# Altium schematic sheet project_pankov_2_mcu.SchDoc: =title_line_1 + title_line_2
size 891 x 420 mm; SheetNumber: 2
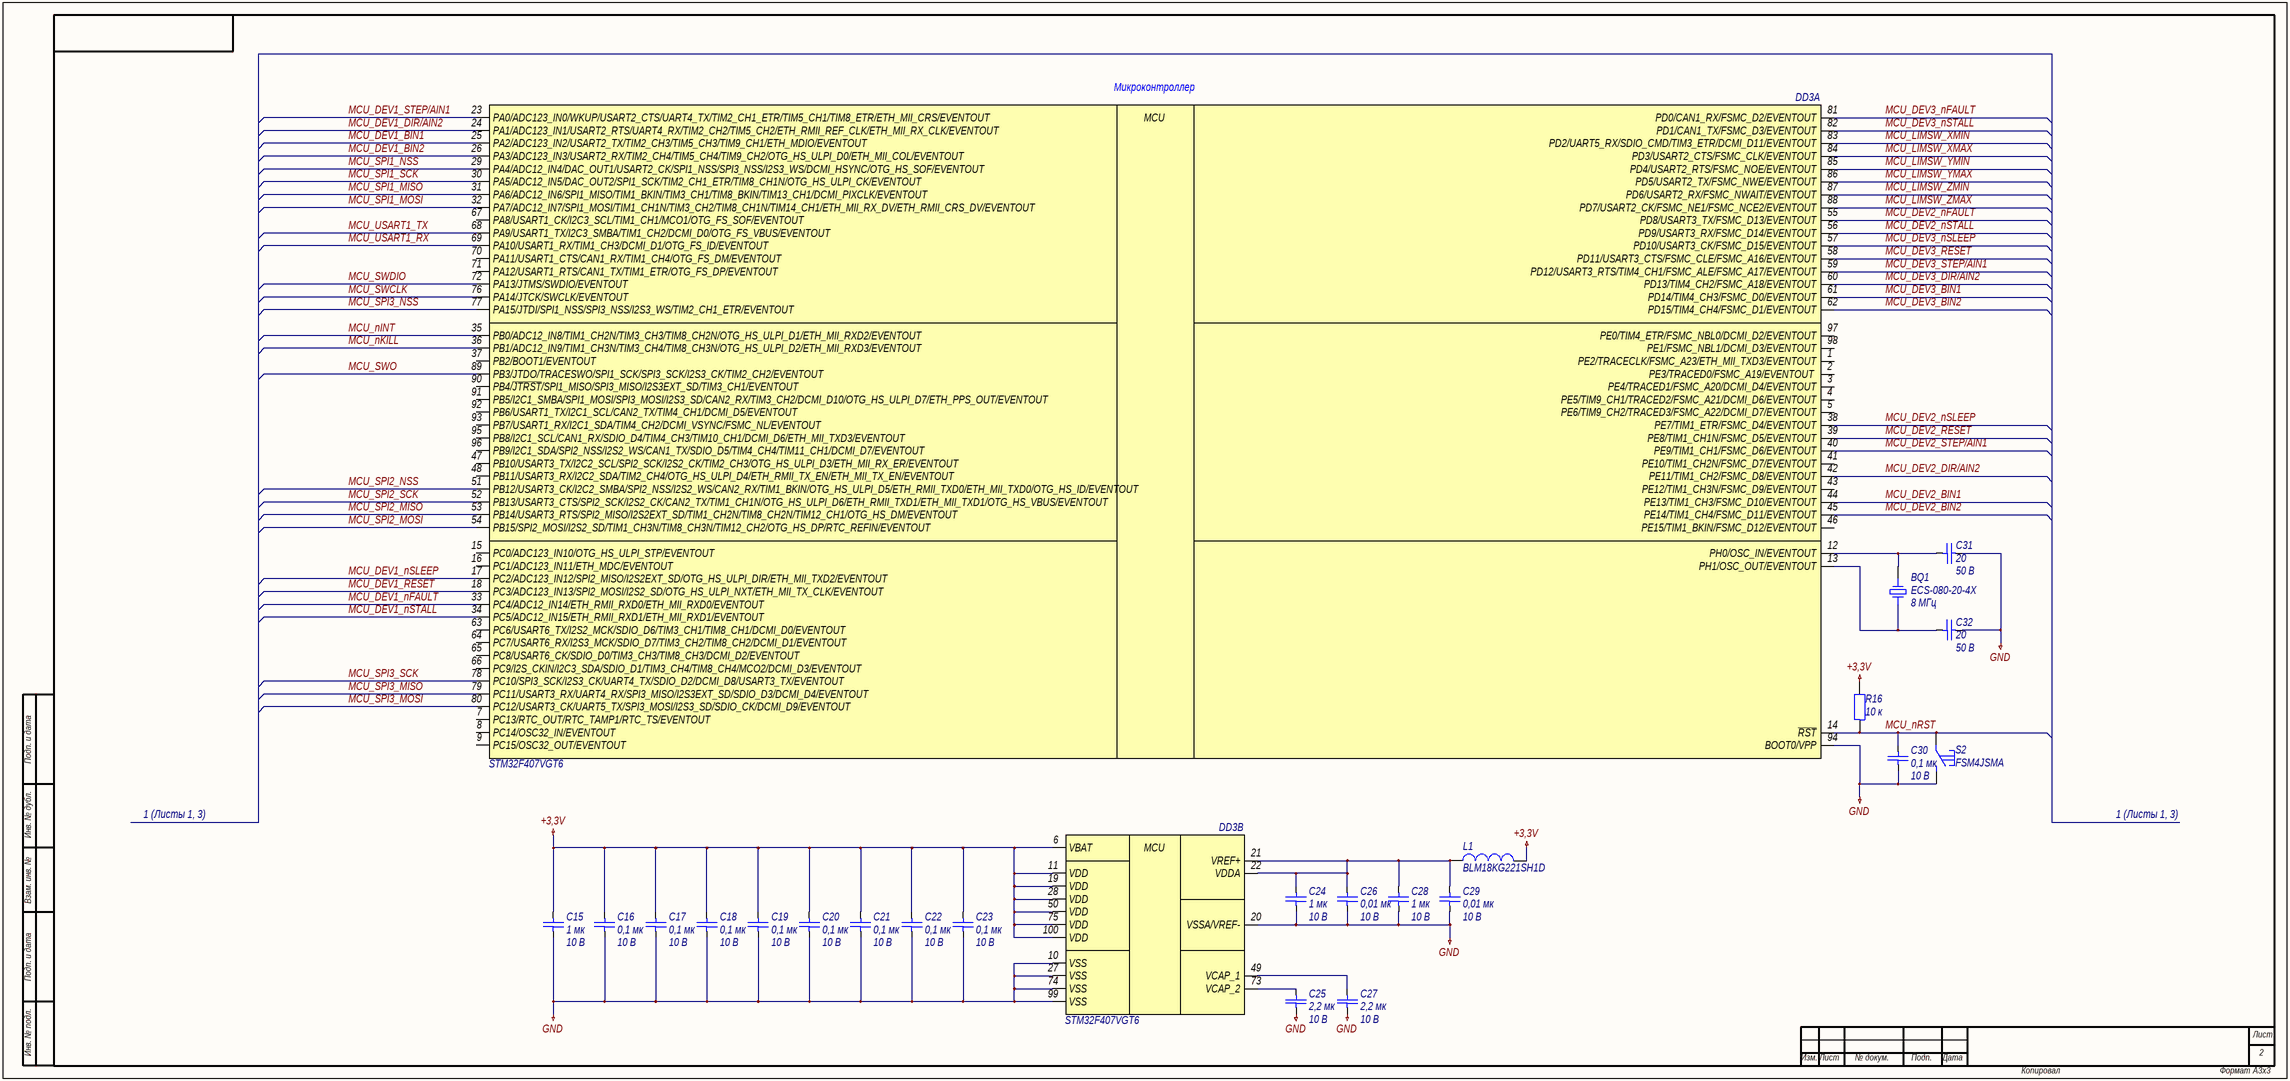
[diagram p0: project_pankov_2_mcu.SchDoc]

## Parts
BQ1  ECS-080-20-4X  Частотa: 8 МГц  [HC-49/US]
C15  1 мк  Напряжение: 10 В  [C0603]
C16  0,1 мк  Напряжение: 10 В  [C0603]
C17  0,1 мк  Напряжение: 10 В  [C0603]
C18  0,1 мк  Напряжение: 10 В  [C0603]
C19  0,1 мк  Напряжение: 10 В  [C0603]
C20  0,1 мк  Напряжение: 10 В  [C0603]
C21  0,1 мк  Напряжение: 10 В  [C0603]
C22  0,1 мк  Напряжение: 10 В  [C0603]
C23  0,1 мк  Напряжение: 10 В  [C0603]
C24  1 мк  Напряжение: 10 В  [C0603]
C25  2,2 мк  Напряжение: 10 В  [C0603]
C26  0,01 мк  Напряжение: 10 В  [C0603]
C27  2,2 мк  Напряжение: 10 В  [C0603]
C28  1 мк  Напряжение: 10 В  [C0603]
C29  0,01 мк  Напряжение: 10 В  [C0603]
C30  0,1 мк  Напряжение: 10 В  [C0603]
C31  20  Напряжение: 50 В  [C0603]
C32  20  Напряжение: 50 В  [C0603]
DD3  STM32F407VGT6  [LQFP-100-P50-1400X1400X160-L60X22]  (parts A,B of 2)
L1  BLM18KG221SH1D  [BLM-2-0603]
R16  10 к  [R0603]
S2  FSM4JSMA  [FSM4JSMA]

## Nets
+3,3V: C15.1 C16.1 C17.1 C18.1 C19.1 C20.1 C21.1 C22.1 C23.1 DD3.6(VBAT) DD3.11(VDD) DD3.19(VDD) DD3.28(VDD) DD3.50(VDD) DD3.75(VDD) DD3.100(VDD) L1.2 R16.2
GND: C15.2 C16.2 C17.2 C18.2 C19.2 C20.2 C21.2 C22.2 C23.2 C24.2 C25.2 C26.2 C27.2 C28.2 C29.2 C30.2 C31.1 C32.1 DD3.10(VSS) DD3.20(VSSA/VREF-) DD3.27(VSS) DD3.74(VSS) DD3.94(BOOT0/VPP) DD3.99(VSS) S2.2
MCU_DEV1_BIN1: DD3.25(PA2/ADC123_IN2/USART2_TX/TIM2_CH3/TIM5_CH3/TIM9_CH1/ETH_MDIO/EVENTOUT)
MCU_DEV1_BIN2: DD3.26(PA3/ADC123_IN3/USART2_RX/TIM2_CH4/TIM5_CH4/TIM9_CH2/OTG_HS_ULPI_D0/ETH_MII_COL/EVENTOUT)
MCU_DEV1_DIR/AIN2: DD3.24(PA1/ADC123_IN1/USART2_RTS/UART4_RX/TIM2_CH2/TIM5_CH2/ETH_RMII_REF_CLK/ETH_MII_RX_CLK/EVENTOUT)
MCU_DEV1_nFAULT: DD3.33(PC4/ADC12_IN14/ETH_RMII_RXD0/ETH_MII_RXD0/EVENTOUT)
MCU_DEV1_nSLEEP: DD3.17(PC2/ADC123_IN12/SPI2_MISO/I2S2EXT_SD/OTG_HS_ULPI_DIR/ETH_MII_TXD2/EVENTOUT)
MCU_DEV1_nSTALL: DD3.34(PC5/ADC12_IN15/ETH_RMII_RXD1/ETH_MII_RXD1/EVENTOUT)
MCU_DEV1_RESET: DD3.18(PC3/ADC123_IN13/SPI2_MOSI/I2S2_SD/OTG_HS_ULPI_NXT/ETH_MII_TX_CLK/EVENTOUT)
MCU_DEV1_STEP/AIN1: DD3.23(PA0/ADC123_IN0/WKUP/USART2_CTS/UART4_TX/TIM2_CH1_ETR/TIM5_CH1/TIM8_ETR/ETH_MII_CRS/EVENTOUT)
MCU_DEV2_BIN1: DD3.44(PE13/TIM1_CH3/FSMC_D10/EVENTOUT)
MCU_DEV2_BIN2: DD3.45(PE14/TIM1_CH4/FSMC_D11/EVENTOUT)
MCU_DEV2_DIR/AIN2: DD3.42(PE11/TIM1_CH2/FSMC_D8/EVENTOUT)
MCU_DEV2_nFAULT: DD3.55(PD8/USART3_TX/FSMC_D13/EVENTOUT)
MCU_DEV2_nSLEEP: DD3.38(PE7/TIM1_ETR/FSMC_D4/EVENTOUT)
MCU_DEV2_nSTALL: DD3.56(PD9/USART3_RX/FSMC_D14/EVENTOUT)
MCU_DEV2_RESET: DD3.39(PE8/TIM1_CH1N/FSMC_D5/EVENTOUT)
MCU_DEV2_STEP/AIN1: DD3.40(PE9/TIM1_CH1/FSMC_D6/EVENTOUT)
MCU_DEV3_BIN1: DD3.61(PD14/TIM4_CH3/FSMC_D0/EVENTOUT)
MCU_DEV3_BIN2: DD3.62(PD15/TIM4_CH4/FSMC_D1/EVENTOUT)
MCU_DEV3_DIR/AIN2: DD3.60(PD13/TIM4_CH2/FSMC_A18/EVENTOUT)
MCU_DEV3_nFAULT: DD3.81(PD0/CAN1_RX/FSMC_D2/EVENTOUT)
MCU_DEV3_nSLEEP: DD3.57(PD10/USART3_CK/FSMC_D15/EVENTOUT)
MCU_DEV3_nSTALL: DD3.82(PD1/CAN1_TX/FSMC_D3/EVENTOUT)
MCU_DEV3_RESET: DD3.58(PD11/USART3_CTS/FSMC_CLE/FSMC_A16/EVENTOUT)
MCU_DEV3_STEP/AIN1: DD3.59(PD12/USART3_RTS/TIM4_CH1/FSMC_ALE/FSMC_A17/EVENTOUT)
MCU_LIMSW_XMAX: DD3.84(PD3/USART2_CTS/FSMC_CLK/EVENTOUT)
MCU_LIMSW_XMIN: DD3.83(PD2/UART5_RX/SDIO_CMD/TIM3_ETR/DCMI_D11/EVENTOUT)
MCU_LIMSW_YMAX: DD3.86(PD5/USART2_TX/FSMC_NWE/EVENTOUT)
MCU_LIMSW_YMIN: DD3.85(PD4/USART2_RTS/FSMC_NOE/EVENTOUT)
MCU_LIMSW_ZMAX: DD3.88(PD7/USART2_CK/FSMC_NE1/FSMC_NCE2/EVENTOUT)
MCU_LIMSW_ZMIN: DD3.87(PD6/USART2_RX/FSMC_NWAIT/EVENTOUT)
MCU_nINT: DD3.35(PB0/ADC12_IN8/TIM1_CH2N/TIM3_CH3/TIM8_CH2N/OTG_HS_ULPI_D1/ETH_MII_RXD2/EVENTOUT)
MCU_nKILL: DD3.36(PB1/ADC12_IN9/TIM1_CH3N/TIM3_CH4/TIM8_CH3N/OTG_HS_ULPI_D2/ETH_MII_RXD3/EVENTOUT)
MCU_nRST: C30.1 DD3.14(~{RST}) R16.1 S2.1
MCU_SPI1_MISO: DD3.31(PA6/ADC12_IN6/SPI1_MISO/TIM1_BKIN/TIM3_CH1/TIM8_BKIN/TIM13_CH1/DCMI_PIXCLK/EVENTOUT)
MCU_SPI1_MOSI: DD3.32(PA7/ADC12_IN7/SPI1_MOSI/TIM1_CH1N/TIM3_CH2/TIM8_CH1N/TIM14_CH1/ETH_MII_RX_DV/ETH_RMII_CRS_DV/EVENTOUT)
MCU_SPI1_NSS: DD3.29(PA4/ADC12_IN4/DAC_OUT1/USART2_CK/SPI1_NSS/SPI3_NSS/I2S3_WS/DCMI_HSYNC/OTG_HS_SOF/EVENTOUT)
MCU_SPI1_SCK: DD3.30(PA5/ADC12_IN5/DAC_OUT2/SPI1_SCK/TIM2_CH1_ETR/TIM8_CH1N/OTG_HS_ULPI_CK/EVENTOUT)
MCU_SPI2_MISO: DD3.53(PB14/USART3_RTS/SPI2_MISO/I2S2EXT_SD/TIM1_CH2N/TIM8_CH2N/TIM12_CH1/OTG_HS_DM/EVENTOUT)
MCU_SPI2_MOSI: DD3.54(PB15/SPI2_MOSI/I2S2_SD/TIM1_CH3N/TIM8_CH3N/TIM12_CH2/OTG_HS_DP/RTC_REFIN/EVENTOUT)
MCU_SPI2_NSS: DD3.51(PB12/USART3_CK/I2C2_SMBA/SPI2_NSS/I2S2_WS/CAN2_RX/TIM1_BKIN/OTG_HS_ULPI_D5/ETH_RMII_TXD0/ETH_MII_TXD0/OTG_HS_ID/EVENTOUT)
MCU_SPI2_SCK: DD3.52(PB13/USART3_CTS/SPI2_SCK/I2S2_CK/CAN2_TX/TIM1_CH1N/OTG_HS_ULPI_D6/ETH_RMII_TXD1/ETH_MII_TXD1/OTG_HS_VBUS/EVENTOUT)
MCU_SPI3_MISO: DD3.79(PC11/USART3_RX/UART4_RX/SPI3_MISO/I2S3EXT_SD/SDIO_D3/DCMI_D4/EVENTOUT)
MCU_SPI3_MOSI: DD3.80(PC12/USART3_CK/UART5_TX/SPI3_MOSI/I2S3_SD/SDIO_CK/DCMI_D9/EVENTOUT)
MCU_SPI3_NSS: DD3.77(PA15/JTDI/SPI1_NSS/SPI3_NSS/I2S3_WS/TIM2_CH1_ETR/EVENTOUT)
MCU_SPI3_SCK: DD3.78(PC10/SPI3_SCK/I2S3_CK/UART4_TX/SDIO_D2/DCMI_D8/USART3_TX/EVENTOUT)
MCU_SWCLK: DD3.76(PA14/JTCK/SWCLK/EVENTOUT)
MCU_SWDIO: DD3.72(PA13/JTMS/SWDIO/EVENTOUT)
MCU_SWO: DD3.89(PB3/JTDO/TRACESWO/SPI1_SCK/SPI3_SCK/I2S3_CK/TIM2_CH2/EVENTOUT)
MCU_USART1_RX: DD3.69(PA10/USART1_RX/TIM1_CH3/DCMI_D1/OTG_FS_ID/EVENTOUT)
MCU_USART1_TX: DD3.68(PA9/USART1_TX/I2C3_SMBA/TIM1_CH2/DCMI_D0/OTG_FS_VBUS/EVENTOUT)
NetBQ1_1: BQ1.1 C32.2 DD3.13(PH1/OSC_OUT/EVENTOUT)
NetBQ1_2: BQ1.2 C31.2 DD3.12(PH0/OSC_IN/EVENTOUT)
NetC24_1: C24.1 C26.1 C28.1 C29.1 DD3.21(VREF+) DD3.22(VDDA) L1.1
NetC25_1: C25.1 DD3.73(VCAP_2)
NetC27_1: C27.1 DD3.49(VCAP_1)

Not connected (* = marked no-connect by the designer): DD3 1(PE2/TRACECLK/FSMC_A23/ETH_MII_TXD3/EVENTOUT) 2(PE3/TRACED0/FSMC_A19/EVENTOUT_) 3(PE4/TRACED1/FSMC_A20/DCMI_D4/EVENTOUT) 4(PE5/TIM9_CH1/TRACED2/FSMC_A21/DCMI_D6/EVENTOUT) 5(PE6/TIM9_CH2/TRACED3/FSMC_A22/DCMI_D7/EVENTOUT) 7(PC13/RTC_OUT/RTC_TAMP1/RTC_TS/EVENTOUT) 8(PC14/OSC32_IN/EVENTOUT) 9(PC15/OSC32_OUT/EVENTOUT) 15(PC0/ADC123_IN10/OTG_HS_ULPI_STP/EVENTOUT) 16(PC1/ADC123_IN11/ETH_MDC/EVENTOUT) 37(PB2/BOOT1/EVENTOUT) 41(PE10/TIM1_CH2N/FSMC_D7/EVENTOUT) 43(PE12/TIM1_CH3N/FSMC_D9/EVENTOUT) 46(PE15/TIM1_BKIN/FSMC_D12/EVENTOUT) 47(PB10/USART3_TX/I2C2_SCL/SPI2_SCK/I2S2_CK/TIM2_CH3/OTG_HS_ULPI_D3/ETH_MII_RX_ER/EVENTOUT) 48(PB11/USART3_RX/I2C2_SDA/TIM2_CH4/OTG_HS_ULPI_D4/ETH_RMII_TX_EN/ETH_MII_TX_EN/EVENTOUT) 63(PC6/USART6_TX/I2S2_MCK/SDIO_D6/TIM3_CH1/TIM8_CH1/DCMI_D0/EVENTOUT) 64(PC7/USART6_RX/I2S3_MCK/SDIO_D7/TIM3_CH2/TIM8_CH2/DCMI_D1/EVENTOUT) 65(PC8/USART6_CK/SDIO_D0/TIM3_CH3/TIM8_CH3/DCMI_D2/EVENTOUT) 66(PC9/I2S_CKIN/I2C3_SDA/SDIO_D1/TIM3_CH4/TIM8_CH4/MCO2/DCMI_D3/EVENTOUT) 67(PA8/USART1_CK/I2C3_SCL/TIM1_CH1/MCO1/OTG_FS_SOF/EVENTOUT) 70(PA11/USART1_CTS/CAN1_RX/TIM1_CH4/OTG_FS_DM/EVENTOUT) 71(PA12/USART1_RTS/CAN1_TX/TIM1_ETR/OTG_FS_DP/EVENTOUT) 90(PB4/~{JTRST}/SPI1_MISO/SPI3_MISO/I2S3EXT_SD/TIM3_CH1/EVENTOUT) 91(PB5/I2C1_SMBA/SPI1_MOSI/SPI3_MOSI/I2S3_SD/CAN2_RX/TIM3_CH2/DCMI_D10/OTG_HS_ULPI_D7/ETH_PPS_OUT/EVENTOUT) 92(PB6/USART1_TX/I2C1_SCL/CAN2_TX/TIM4_CH1/DCMI_D5/EVENTOUT) 93(PB7/USART1_RX/I2C1_SDA/TIM4_CH2/DCMI_VSYNC/FSMC_NL/EVENTOUT) 95(PB8/I2C1_SCL/CAN1_RX/SDIO_D4/TIM4_CH3/TIM10_CH1/DCMI_D6/ETH_MII_TXD3/EVENTOUT) 96(PB9/I2C1_SDA/SPI2_NSS/I2S2_WS/CAN1_TX/SDIO_D5/TIM4_CH4/TIM11_CH1/DCMI_D7/EVENTOUT) 97(PE0/TIM4_ETR/FSMC_NBL0/DCMI_D2/EVENTOUT) 98(PE1/FSMC_NBL1/DCMI_D3/EVENTOUT)

## Notes on the sheet
- (near DD3) Микроконтроллер
- 1 (Листы 1, 3)
- Подп. и дата
- Инв. № дубл.
- Взам. инв. №
- Инв. № подл.
- Лист
- Изм.
- № докум.
- Подп.
- Дата
- Копировал
- Формат
- А3х3
- (in symbol dd0002, part A) MCU
- (in symbol dd0002, part B) MCU

## Library data of the parts
BQ1 = bq0004: =Описание; ID: bq0004; Фамилия: Паньков; Описание: Кварцевый резонатор 8 МГц нагрузочные конденсаторы 20 пФ; Производитель: ECS, Inc. International; Наименование: ECS-080-20-4X; Частота: 8 МГц; Корпус: HC-49/US; HelpURL: https://ecsxtal.com/hc-49usx
C15 C24 C28 = c0086: =Описание; ID: c0086; Фамилия: Паньков; Описание: Конденсатор керамический чип 0603 1 мкФ 10 В ±10 %; Наименование: CC0603KRX7R6BB105; Производитель: YAGEO Corp.; Отклонение: ±10 %; Рабочие температуры: от –55 °С до +125 °С; Температурный коэффициент емкости: X7R; Корпус: 0603; Номинал: 1 мк; Номинальное напряжение: 10 В; HelpURL: https://www.yageo.com/upload/media/product/productsearch/datasheet/mlcc/UPY-GPHC_X7R_6.3V-to-50V_20.pdf
C16-C23 = c0054: =Описание; ID: c0054; Фамилия: Паньков; Описание: Конденсатор керамический чип 0603 100 нФ 10 В ±10 %; Наименование: CC0603KRX7R6BB104; Производитель: YAGEO Corp.; Отклонение: ±10 %; Рабочие температуры: от –55 °С до +125 °С; Температурный коэффициент емкости: X7R; Корпус: 0603; Номинал: 0,1 мк; Номинальное напряжение: 10 В; HelpURL: https://www.yageo.com/upload/media/product/productsearch/datasheet/mlcc/UPY-GPHC_X7R_6.3V-to-50V_20.pdf
C25 C27 = c0097: =Описание; ID: c0097; Фамилия: Чернов; Описание: Конденсатор керамический чип 0603 2,2 мкФ 10 В ±10 %; Наименование: CC0603KRX7R6BB225; Производитель: YAGEO Corp.; Отклонение: ±10 %; Рабочие температуры: от –55 °С до +125 °С; Температурный коэффициент емкости: X7R; Корпус: 0603; Номинал: 2,2 мк; Номинальное напряжение: 10 В; HelpURL: https://www.yageo.com/upload/media/product/productsearch/datasheet/mlcc/UPY-GPHC_X7R_6.3V-to-50V_20.pdf
C26 C29 = c0033: =Описание; ID: c0033; Фамилия: Паньков; Описание: Конденсатор керамический чип 0603 10 нФ 10 В ±10 %; Наименование: CC0603KRX7R6BB103; Производитель: YAGEO Corp.; Отклонение: ±10 %; Рабочие температуры: от –55 °С до +125 °С; Температурный коэффициент емкости: X7R; Корпус: 0603; Номинал: 0,01 мк; Номинальное напряжение: 10 В; HelpURL: https://www.yageo.com/upload/media/product/productsearch/datasheet/mlcc/UPY-GPHC_X7R_6.3V-to-50V_20.pdf
C30 = c0057: =Описание; ID: c0057; Фамилия: Паньков; Описание: Конденсатор керамический чип 0603 100 нФ 10 В ±10 %; Наименование: CC0603KRX7R6BB104; Производитель: YAGEO Corp.; Отклонение: ±10 %; Рабочие температуры: от –55 °С до +125 °С; Температурный коэффициент емкости: X7R; Корпус: 0603; Номинал: 0,1 мк; Номинальное напряжение: 10 В; HelpURL: https://www.yageo.com/upload/media/product/productsearch/datasheet/mlcc/UPY-GPHC_X7R_6.3V-to-50V_20.pdf
C31 C32 = c0019: =Описание; ID: c0019; Фамилия: Паньков; Описание: Конденсатор керамический чип 0603 20 пФ 50 В ±1 %; Наименование: CC0603FRNPO9BN200; Производитель: YAGEO Corp.; Отклонение: ±1 %; Рабочие температуры: от –55 °С до +125 °С; Температурный коэффициент емкости: C0G; Корпус: 0603; Номинал: 20; Номинальное напряжение: 50 В; HelpURL: https://www.yageo.com/upload/media/product/productsearch/datasheet/mlcc/UPY-GP_NP0_16V-to-50V_18.pdf
DD3 = dd0002: =Описание; ID: dd0002; Фамилия: Паньков; Описание: ARM Cortex-M4 32-разрядный микроконтроллер 168 МГц 1 Мбайт FLASH-памяти; Производитель: STMicroelectronics; Рабочее напряжение: от 1,8 В до 3,6 В; Максимальная тактовая частота: 168 МГц; Поддерживаемые интерфейсы: CAN, I2C, SDIO, I2S/SPI, UART/USART, USB; Рабочие температуры: от –40 °С до +85 °С; Корпус: LQFP-100; Наименование: STM32F407VGT6; HelpURL: https://www.st.com/en/microcontrollers-microprocessors/stm32f407vg.html
L1 = l0001: =Описание; ID: l0001; Фамилия: Ларионов; Описание: Ферритовая бусина 220 Ом ±25 %; Производитель: Murata Manufacturing Co., Ltd.; Сопротивление, 100 МГц: 220 Ом; Отклонение, 100 МГц: ±25 %; Сопротивление при постоянном токе: 0,05 Ом; Рабочие температуры: от –55 °С до +125 °С; Корпус: 0603; Наименование: BLM18KG221SH1D; HelpURL: https://www.murata.com/en-global/products/productdetail?partno=BLM18KG221SH1%23
R16 = r0105: =Описание; ID: r0105; Фамилия: Самарин; Описание: Резистор чип 0603 10 кОм ±1 % 0,1 Вт; Наименование: RC0603FR-0710KL; Производитель: YAGEO Corp.; Отклонение: ±1 %; Номинальное напряжение: 75 В; Номинальный ток: 1 А; Рабочие температуры: от –55 °С до +155 °С; Корпус: 0603; Примечание: Ряд E24; Номинал: 10 к; HelpURL: https://www.yageo.com/upload/media/product/productsearch/datasheet/rchip/PYu-RC_Group_51_RoHS_L_11.pdf
S2 = s0001: =Описание; ID: s0001; Фамилия: Паньков; Описание: Тактовая кнопка поверхностного монтажа; Производитель: TE Connectivity; Ток нагрузки: 50 мА @ 24 В; Сопротивление контакта: 100 мОм; Количество контактов: 4; Рабочие температуры: от –35 °С до +85 °С; Промывка: Запрещена; Корпус: 6,00 x 6,00 x 4,98; Наименование: FSM4JSMA; HelpURL: https://www.te.com/usa-en/product-4-1437565-1.html